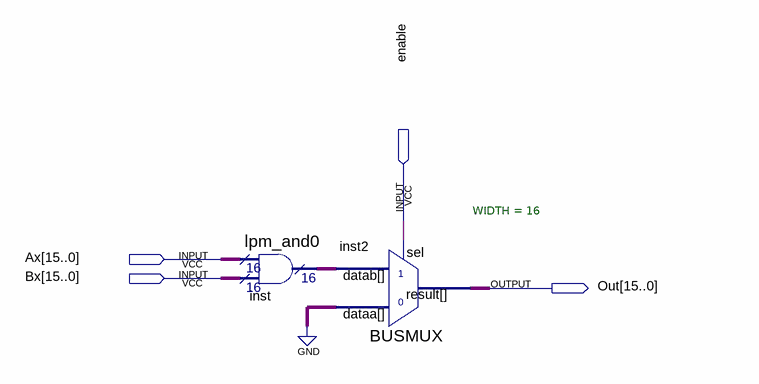
[diagram p0: schematic sheet]
// Quartus schematic ALU_AND.bdf as structural Verilog: 2 symbols, 4 pins
module ALU_AND (
  input  enable,
  input  [15:0] Ax,
  input  [15:0] Bx,
  output [15:0] Out
);

  wire [15:0] inst_result;

  lpm_and0 inst (.data0x(Ax), .data1x(Bx), .result(inst_result));
  BUSMUX #(.WIDTH(16)) inst2 (.datab(inst_result), .sel(enable), .dataa({16{1'b0}}), .result(Out));
endmodule
